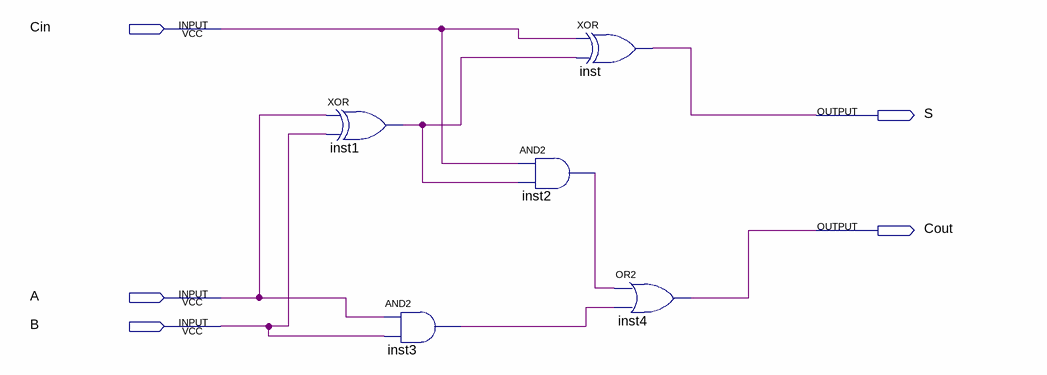
[diagram p0: schematic sheet]
// Quartus schematic block1.bdf as structural Verilog: 5 symbols, 5 pins
module block1 (
  input  Cin,
  input  A,
  input  B,
  output S,
  output Cout
);

  wire inst1_out, inst2_out, inst3_out;

  xor inst1 (inst1_out, A, B);
  and inst3 (inst3_out, A, B);
  and inst2 (inst2_out, Cin, inst1_out);
  xor inst (S, Cin, inst1_out);
  or inst4 (Cout, inst2_out, inst3_out);
endmodule
